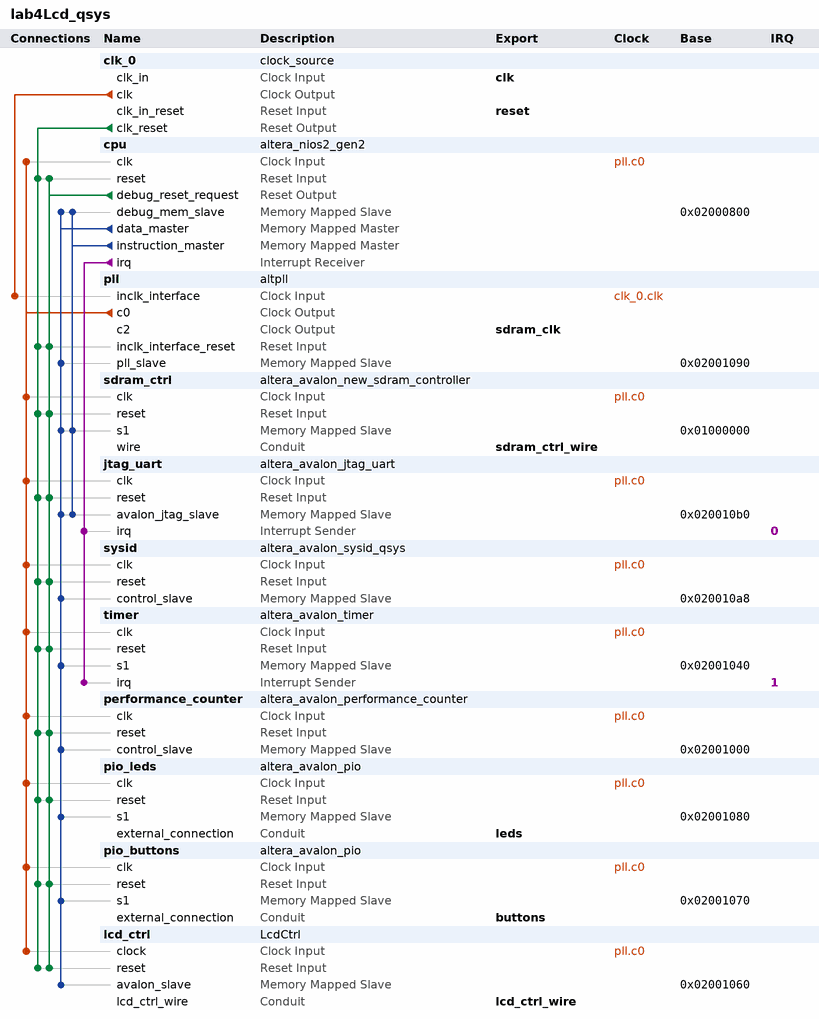
[diagram p0: system contents]
# Platform Designer (Qsys) system lab4Lcd_qsys, Cyclone IV E EP4CE30F23C7
# Parameters at their usual value, and those the tool derives, are not listed.
package require -exact qsys 18.1
create_system lab4Lcd_qsys
set_project_property DEVICE_FAMILY {Cyclone IV E}
set_project_property DEVICE EP4CE30F23C7

add_instance clk_0 clock_source 18.1
set_instance_parameter_value clk_0 clockFrequency 50000000

add_instance cpu altera_nios2_gen2 18.1
set_instance_parameter_value cpu dcache_size 2048
set_instance_parameter_value cpu exceptionSlave sdram_ctrl.s1
set_instance_parameter_value cpu icache_size 4096
set_instance_parameter_value cpu impl Fast
set_instance_parameter_value cpu resetSlave sdram_ctrl.s1

add_instance pll altpll 18.1
set_instance_parameter_value pll CLK0_DIVIDE_BY 2
set_instance_parameter_value pll CLK0_MULTIPLY_BY 1
set_instance_parameter_value pll CLK2_DIVIDE_BY 2
set_instance_parameter_value pll CLK2_DUTY_CYCLE 50
set_instance_parameter_value pll CLK2_MULTIPLY_BY 1
set_instance_parameter_value pll CLK2_PHASE_SHIFT 0
set_instance_parameter_value pll INCLK0_INPUT_FREQUENCY 10000
set_instance_parameter_value pll PORT_ARESET PORT_UNUSED
set_instance_parameter_value pll PORT_LOCKED PORT_UNUSED
set_instance_parameter_value pll PORT_clk1 PORT_UNUSED
set_instance_parameter_value pll PORT_clk2 PORT_USED
set_instance_parameter_value pll PORT_clk3 PORT_UNUSED

add_instance sdram_ctrl altera_avalon_new_sdram_controller 18.1
set_instance_parameter_value sdram_ctrl TAC 5.5
set_instance_parameter_value sdram_ctrl TRCD 20.0
set_instance_parameter_value sdram_ctrl TRP 20.0
set_instance_parameter_value sdram_ctrl casLatency 3
set_instance_parameter_value sdram_ctrl columnWidth 9
set_instance_parameter_value sdram_ctrl dataWidth 16
set_instance_parameter_value sdram_ctrl generateSimulationModel false
set_instance_parameter_value sdram_ctrl model single_Micron_MT48LC4M32B2_7_chip
set_instance_parameter_value sdram_ctrl numberOfBanks 4
set_instance_parameter_value sdram_ctrl numberOfChipSelects 1
set_instance_parameter_value sdram_ctrl powerUpDelay 100.0
set_instance_parameter_value sdram_ctrl refreshPeriod 15.625
set_instance_parameter_value sdram_ctrl rowWidth 12

add_instance jtag_uart altera_avalon_jtag_uart 18.1
set_instance_parameter_value jtag_uart simInteractiveOptions NO_INTERACTIVE_WINDOWS

add_instance sysid altera_avalon_sysid_qsys 18.1
set_instance_parameter_value sysid id -559038737

add_instance timer altera_avalon_timer 18.1
set_instance_parameter_value timer fixedPeriod true
set_instance_parameter_value timer period 10
set_instance_parameter_value timer periodUnits MSEC

add_instance performance_counter altera_avalon_performance_counter 18.1
set_instance_parameter_value performance_counter numberOfSections 3

add_instance pio_leds altera_avalon_pio 18.1
set_instance_parameter_value pio_leds direction Output
set_instance_parameter_value pio_leds width 8

add_instance pio_buttons altera_avalon_pio 18.1
set_instance_parameter_value pio_buttons direction Input
set_instance_parameter_value pio_buttons width 8

add_instance lcd_ctrl LcdCtrl 18.1

# connections
add_connection clk_0.clk pll.inclk_interface clock
add_connection pll.c0 cpu.clk clock
add_connection pll.c0 jtag_uart.clk clock
add_connection pll.c0 lcd_ctrl.clock clock
add_connection pll.c0 performance_counter.clk clock
add_connection pll.c0 pio_buttons.clk clock
add_connection pll.c0 pio_leds.clk clock
add_connection pll.c0 sdram_ctrl.clk clock
add_connection pll.c0 sysid.clk clock
add_connection pll.c0 timer.clk clock
add_connection clk_0.clk_reset cpu.reset reset
add_connection clk_0.clk_reset jtag_uart.reset reset
add_connection clk_0.clk_reset lcd_ctrl.reset reset
add_connection clk_0.clk_reset performance_counter.reset reset
add_connection clk_0.clk_reset pio_buttons.reset reset
add_connection clk_0.clk_reset pio_leds.reset reset
add_connection clk_0.clk_reset pll.inclk_interface_reset reset
add_connection clk_0.clk_reset sdram_ctrl.reset reset
add_connection clk_0.clk_reset sysid.reset reset
add_connection clk_0.clk_reset timer.reset reset
add_connection cpu.debug_reset_request cpu.reset reset
add_connection cpu.debug_reset_request jtag_uart.reset reset
add_connection cpu.debug_reset_request lcd_ctrl.reset reset
add_connection cpu.debug_reset_request performance_counter.reset reset
add_connection cpu.debug_reset_request pio_buttons.reset reset
add_connection cpu.debug_reset_request pio_leds.reset reset
add_connection cpu.debug_reset_request pll.inclk_interface_reset reset
add_connection cpu.debug_reset_request sdram_ctrl.reset reset
add_connection cpu.debug_reset_request sysid.reset reset
add_connection cpu.debug_reset_request timer.reset reset
add_connection cpu.data_master cpu.debug_mem_slave avalon
set_connection_parameter_value cpu.data_master/cpu.debug_mem_slave baseAddress 0x02000800
add_connection cpu.data_master jtag_uart.avalon_jtag_slave avalon
set_connection_parameter_value cpu.data_master/jtag_uart.avalon_jtag_slave baseAddress 0x020010b0
add_connection cpu.data_master lcd_ctrl.avalon_slave avalon
set_connection_parameter_value cpu.data_master/lcd_ctrl.avalon_slave baseAddress 0x02001060
add_connection cpu.data_master performance_counter.control_slave avalon
set_connection_parameter_value cpu.data_master/performance_counter.control_slave baseAddress 0x02001000
add_connection cpu.data_master pio_buttons.s1 avalon
set_connection_parameter_value cpu.data_master/pio_buttons.s1 baseAddress 0x02001070
add_connection cpu.data_master pio_leds.s1 avalon
set_connection_parameter_value cpu.data_master/pio_leds.s1 baseAddress 0x02001080
add_connection cpu.data_master pll.pll_slave avalon
set_connection_parameter_value cpu.data_master/pll.pll_slave baseAddress 0x02001090
add_connection cpu.data_master sdram_ctrl.s1 avalon
set_connection_parameter_value cpu.data_master/sdram_ctrl.s1 baseAddress 0x01000000
add_connection cpu.data_master sysid.control_slave avalon
set_connection_parameter_value cpu.data_master/sysid.control_slave baseAddress 0x020010a8
add_connection cpu.data_master timer.s1 avalon
set_connection_parameter_value cpu.data_master/timer.s1 baseAddress 0x02001040
add_connection cpu.instruction_master cpu.debug_mem_slave avalon
set_connection_parameter_value cpu.instruction_master/cpu.debug_mem_slave baseAddress 0x02000800
add_connection cpu.instruction_master jtag_uart.avalon_jtag_slave avalon
set_connection_parameter_value cpu.instruction_master/jtag_uart.avalon_jtag_slave baseAddress 0x020010b0
add_connection cpu.instruction_master sdram_ctrl.s1 avalon
set_connection_parameter_value cpu.instruction_master/sdram_ctrl.s1 baseAddress 0x01000000
add_connection cpu.irq jtag_uart.irq interrupt
set_connection_parameter_value cpu.irq/jtag_uart.irq irqNumber 0
add_connection cpu.irq timer.irq interrupt
set_connection_parameter_value cpu.irq/timer.irq irqNumber 1

# exported interfaces
add_interface buttons conduit end
set_interface_property buttons EXPORT_OF pio_buttons.external_connection
add_interface clk clock sink
set_interface_property clk EXPORT_OF clk_0.clk_in
add_interface lcd_ctrl_wire conduit end
set_interface_property lcd_ctrl_wire EXPORT_OF lcd_ctrl.lcd_ctrl_wire
add_interface leds conduit end
set_interface_property leds EXPORT_OF pio_leds.external_connection
add_interface reset reset sink
set_interface_property reset EXPORT_OF clk_0.clk_in_reset
add_interface sdram_clk clock source
set_interface_property sdram_clk EXPORT_OF pll.c2
add_interface sdram_ctrl_wire conduit end
set_interface_property sdram_ctrl_wire EXPORT_OF sdram_ctrl.wire

set_interconnect_requirement {$system} qsys_mm.clockCrossingAdapter HANDSHAKE
set_interconnect_requirement {$system} qsys_mm.enableEccProtection FALSE
set_interconnect_requirement {$system} qsys_mm.insertDefaultSlave FALSE
set_interconnect_requirement {$system} qsys_mm.maxAdditionalLatency 1

save_system lab4Lcd_qsys.qsys
